# EAGLE design M5amigo (EAGLE 9.6.2)
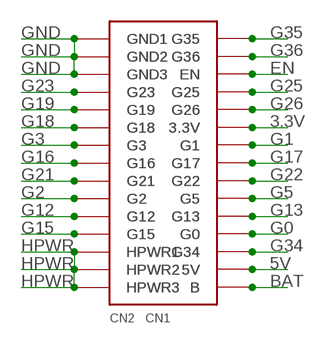
[diagram p0: schematic, sheet 1]

## Parts
CN1  CON_PINHD-2X15_BOTTOM  [2X15SMD]
CN2  CON_PINHD-2X15_TOP  [2X15SMD]

## Nets
3.3V: CN1.P$11(3.3V) CN2.P$12(3.3V)
5V: CN1.P$27(5V) CN2.P$28(5V)
BAT: CN1.P$29(B) CN2.P$30(B)
EN: CN1.P$5(EN) CN2.P$6(EN)
G0: CN1.P$23(G0) CN2.P$24(G0)
G1: CN1.P$13(G1) CN2.P$14(G1)
G2: CN1.P$20(G2) CN2.P$19(G2)
G3: CN1.P$14(G3) CN2.P$13(G3)
G5: CN1.P$19(G5) CN2.P$20(G5)
G12: CN1.P$22(G12) CN2.P$21(G12)
G13: CN1.P$21(G13) CN2.P$22(G13)
G15: CN1.P$24(G15) CN2.P$23(G15)
G16: CN1.P$16(G16) CN2.P$15(G16)
G17: CN1.P$15(G17) CN2.P$16(G17)
G18: CN1.P$12(G18) CN2.P$11(G18)
G19: CN1.P$10(G19) CN2.P$9(G19)
G21: CN1.P$18(G21) CN2.P$17(G21)
G22: CN1.P$17(G22) CN2.P$18(G22)
G23: CN1.P$8(G23) CN2.P$7(G23)
G25: CN1.P$7(G25) CN2.P$8(G25)
G26: CN1.P$9(G26) CN2.P$10(G26)
G34: CN1.P$25(G34) CN2.P$26(G34)
G35: CN1.P$1(G35) CN2.P$2(G35)
G36: CN1.P$3(G36) CN2.P$4(G36)
GND: CN1.P$2(GND1) CN1.P$4(GND2) CN1.P$6(GND3) CN2.P$1(GND1) CN2.P$3(GND2) CN2.P$5(GND3)
HPWR: CN1.P$26(HPWR1) CN1.P$28(HPWR2) CN1.P$30(HPWR3) CN2.P$25(HPWR1) CN2.P$27(HPWR2) CN2.P$29(HPWR3)

## Library data of the parts
CN1 = akita:CON_PINHD-2X15_BOTTOM
CN2 = akita:CON_PINHD-2X15_TOP

## Board
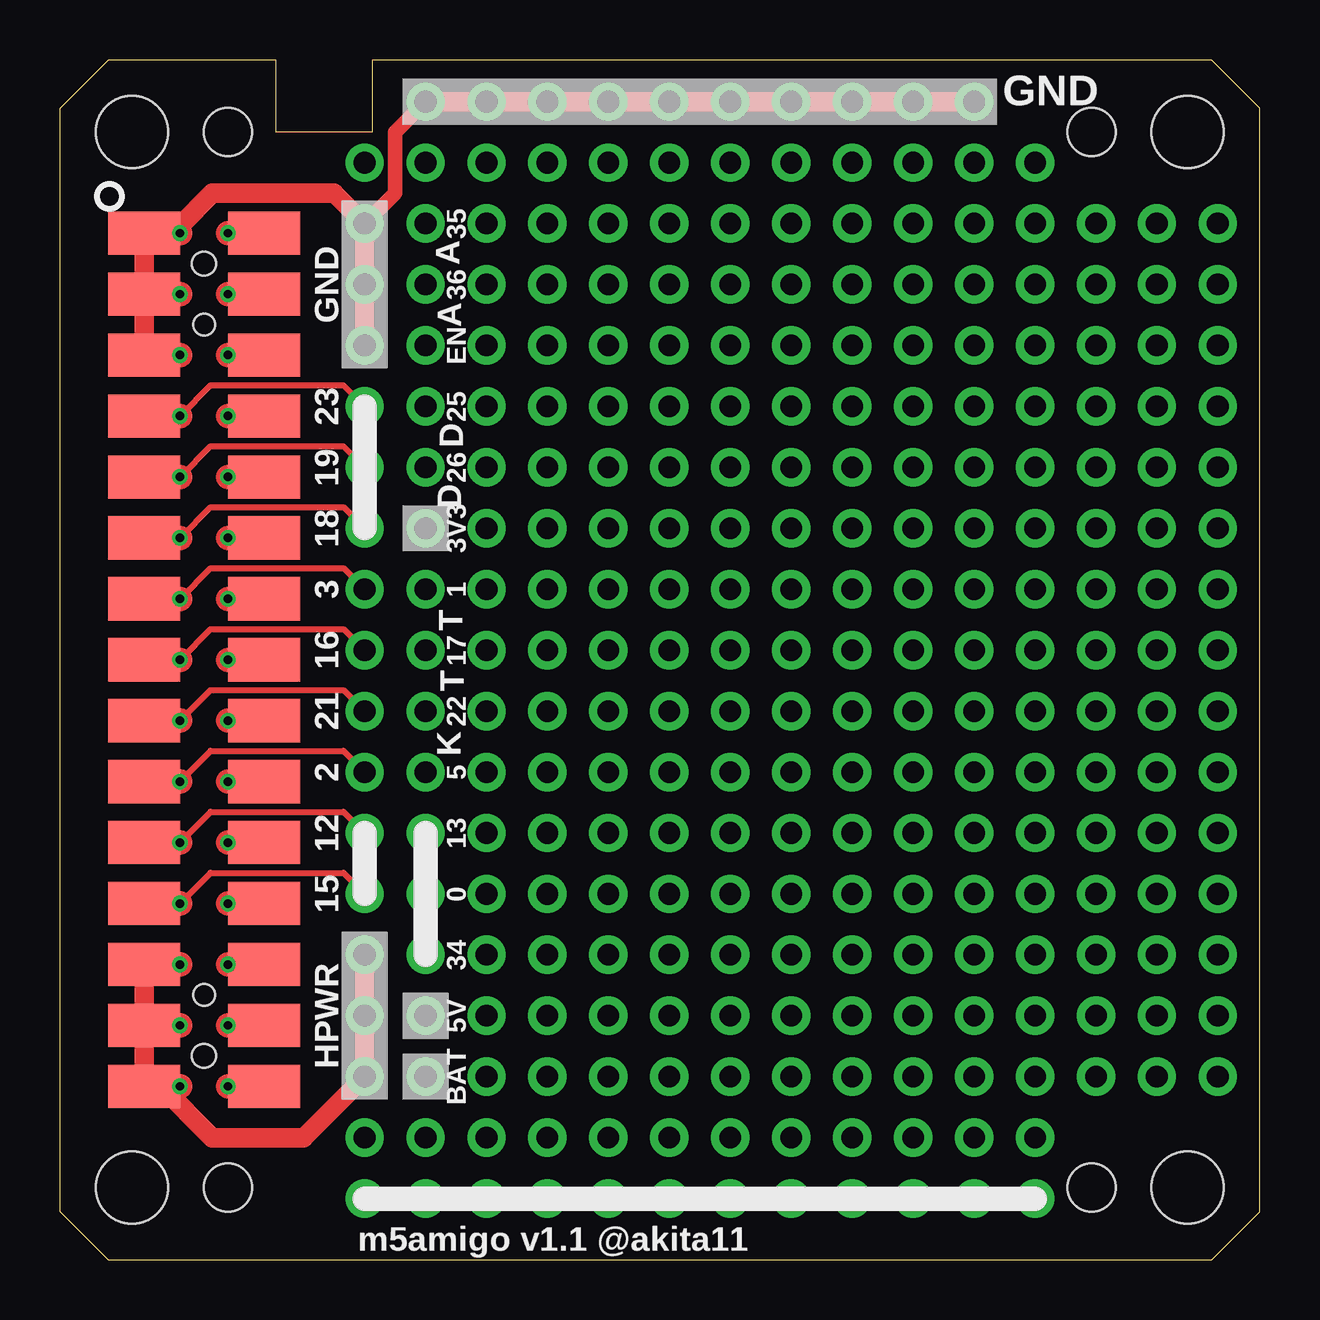
[diagram p1: board, top side]
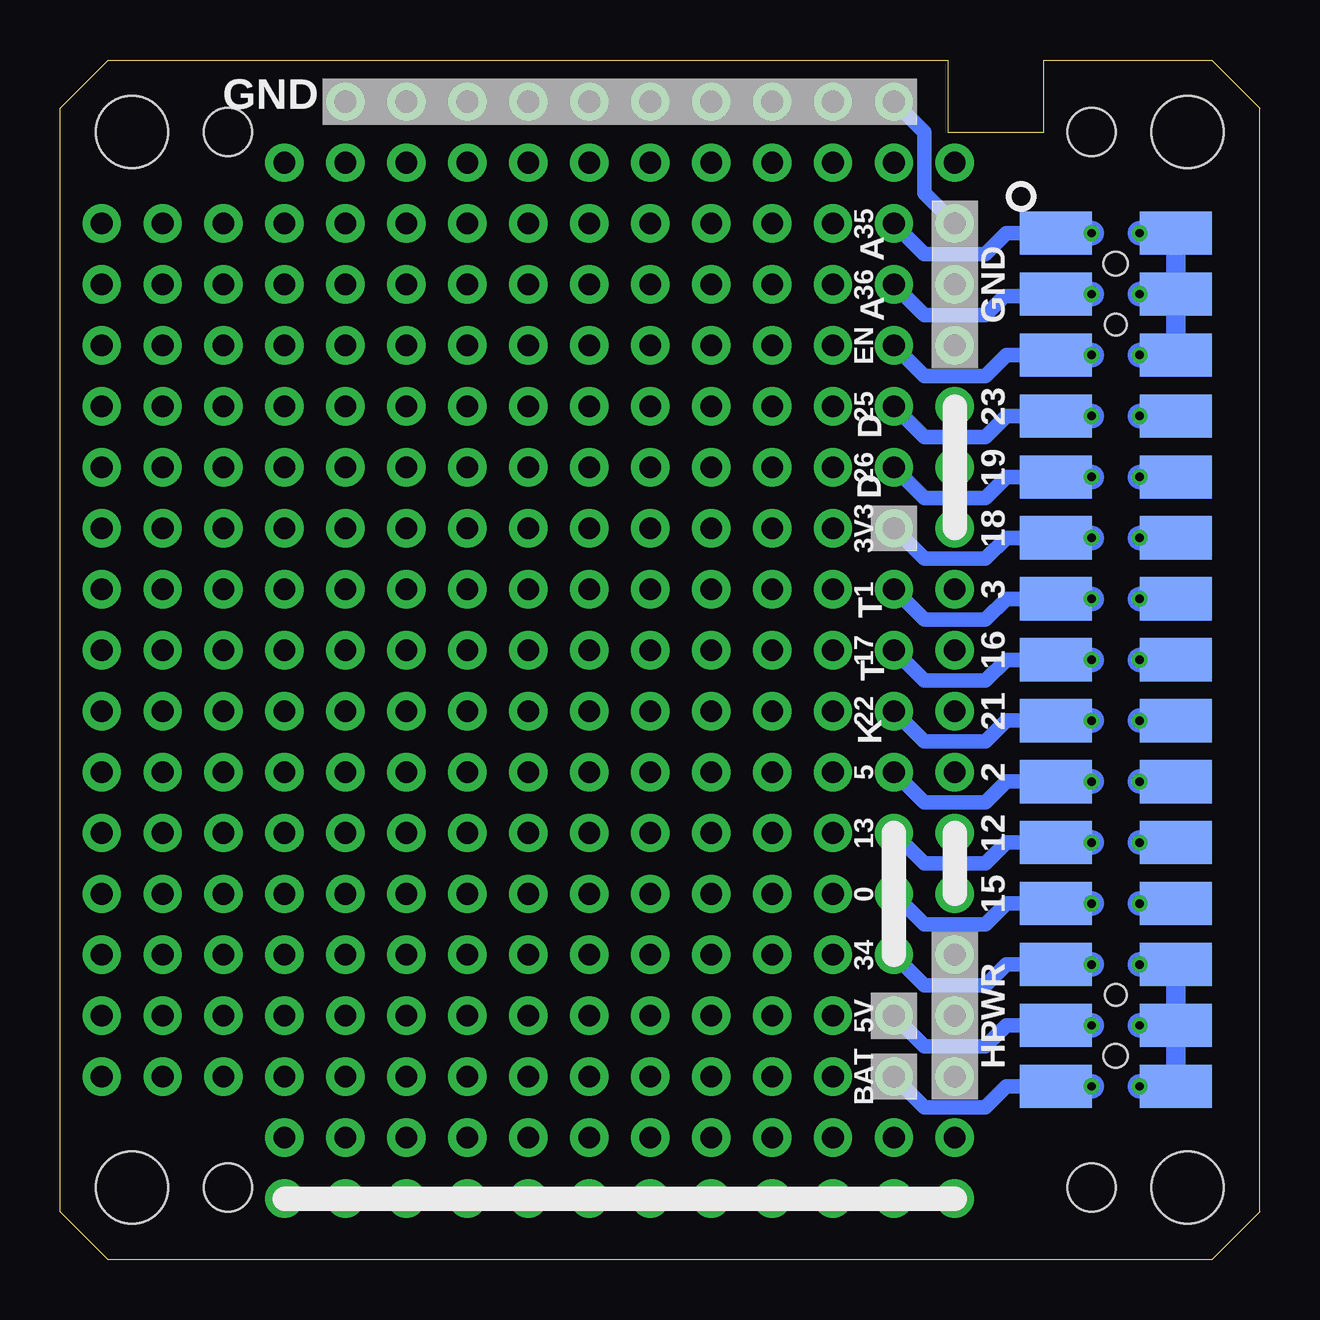
[diagram p2: board, bottom side, seen from below]

Size 50 x 50 mm. Coordinates in mm from the lower left corner, seen from the top.
Outline: 0,2 2,0 48,0 50,2 50,48 48,50 13,50 13,47 9,47 9,50 2,50 0,48 0,2
Copper layers (1*16): Top 0.035mm / dielectric 1.5mm / Bottom 0.035mm
Design rules "SeeedStudio_2layer_DRU_no_angle_20140221": minimum track width 6mil, minimum drill 12mil, track to track 6mil, track to pad 6mil, pad to pad 6mil, via to via 6mil, smd to smd 0mil, copper to edge 10mil, drill to drill 10mil, minimum pad ring 10mil, minimum via ring 6mil, stop-mask expansion 2mil, vias tented up to drill 100mil, thermal gap 10mil
Holes 3 mm at 3,3 3,47 47,47 47,3
Holes 2 mm at 7,3 7,47 43,47 43,3
Holes 1 mm at 6,41.51 6,8.49
Holes 0.9 mm at 6,38.97 6,11.03

### Footprints (pad centres in the part's own frame; a part is rotated, then mirrored left to right if it is on the bottom)
2X15SMD = smd 3 x 1.8: P$1 -2.5,17.78; P$2 2.5,17.78; P$3 -2.5,15.24; P$4 2.5,15.24; P$5 -2.5,12.7; P$6 2.5,12.7; P$7 -2.5,10.16; P$8 2.5,10.16; P$9 -2.5,7.62; P$10 2.5,7.62; P$11 -2.5,5.08; P$12 2.5,5.08; P$13 -2.5,2.54; P$14 2.5,2.54; P$15 -2.5,0; P$16 2.5,0; P$17 -2.5,-2.54; P$18 2.5,-2.54; P$19 -2.5,-5.08; P$20 2.5,-5.08; P$21 -2.5,-7.62; P$22 2.5,-7.62; P$23 -2.5,-10.16; P$24 2.5,-10.16; P$25 -2.5,-12.7; P$26 2.5,-12.7; P$27 -2.5,-15.24; P$28 2.5,-15.24; P$29 -2.5,-17.78; P$30 2.5,-17.78

### Placement (x,y rotation side)
CN1  6,25 0 bottom
CN2  6,25 0 top

### Tracks (layer width: path | path; a pad name or v marks a point on that pad's centre or on a via)
3.3V  (via drill 0.35, 0.9 pad 1.6)
  Top 1.016: CN1.P$11 v7,30.08
  Bottom 0.61: v15.24,30.48 13.97,29.21 11.43,29.21 10.56,30.08 CN1.P$11
  Bottom 1.016: v7,30.08 CN1.P$11
5V  (via drill 0.35, 0.9 pad 1.6)
  Top 1.016: CN1.P$27 v7,9.76
  Bottom 0.61: v15.24,10.16 13.97,8.89 11.43,8.89 10.56,9.76 CN1.P$27
  Bottom 1.016: v7,9.76 CN1.P$27
BAT  (via drill 0.35, 0.9 pad 1.6)
  Top 1.016: v7,7.22 CN1.P$29
  Bottom 0.61: v15.24,7.62 13.97,6.35 11.43,6.35 10.56,7.22 CN1.P$29
  Bottom 1.016: CN1.P$29 v7,7.22
EN  (via drill 0.35, 0.9 pad 1.6)
  Top 1.016: v7,37.7 CN1.P$5
  Bottom 0.61: v15.24,38.1 13.97,36.83 11.43,36.83 10.56,37.7 CN1.P$5
  Bottom 1.016: CN1.P$5 v7,37.7
G0  (via drill 0.35, 0.9 pad 1.6)
  Top 1.016: CN1.P$23 v7,14.84
  Bottom 0.61: v15.24,15.24 13.97,13.97 11.43,13.97 10.56,14.84 CN1.P$23
  Bottom 1.016: v7,14.84 CN1.P$23
G1  (via drill 0.35, 0.9 pad 1.6)
  Top 1.016: v7,27.54 CN1.P$13
  Bottom 0.61: v15.24,27.94 13.97,26.67 11.43,26.67 10.56,27.54 CN1.P$13
  Bottom 1.016: CN1.P$13 v7,27.54
G2  (via drill 0.35, 0.9 pad 1.6)
  Top 0.254: v12.7,20.32 11.82,21.2 6.28,21.2 v5,19.92
  Top 0.61: 5.16,19.92 v5,19.92
  Top 1.016: v5,19.92 CN1.P$20
  Bottom 1.016: CN1.P$20 v5,19.92
G3  (via drill 0.35, 0.9 pad 1.6)
  Top 0.254: v12.7,27.94 11.82,28.82 6.28,28.82 v5,27.54
  Top 1.016: CN1.P$14 v5,27.54
  Bottom 1.016: v5,27.54 CN1.P$14
G5  (via drill 0.35, 0.9 pad 1.6)
  Top 1.016: CN1.P$19 v7,19.92
  Bottom 0.61: v15.24,20.32 13.97,19.05 11.43,19.05 10.56,19.92 CN1.P$19
  Bottom 1.016: v7,19.92 CN1.P$19
G12  (via drill 0.35, 0.9 pad 1.6)
  Top 0.254: 5.32,17.38 v5,17.38 6.28,18.66 11.82,18.66 v12.7,17.78
  Top 1.016: CN1.P$22 v5,17.38
  Bottom 1.016: v5,17.38 CN1.P$22
G13  (via drill 0.35, 0.9 pad 1.6)
  Top 1.016: v7,17.38 CN1.P$21
  Bottom 0.61: v15.24,17.78 13.97,16.51 11.43,16.51 10.56,17.38 CN1.P$21
  Bottom 1.016: CN1.P$21 v7,17.38
G15  (via drill 0.35, 0.9 pad 1.6)
  Top 0.254: v12.7,15.24 11.82,16.12 6.28,16.12 v5,14.84
  Top 1.016: v5,14.84 CN1.P$24
  Bottom 1.016: CN1.P$24 v5,14.84
G16  (via drill 0.35, 0.9 pad 1.6)
  Top 0.254: v12.7,25.4 11.82,26.28 6.28,26.28 v5,25
  Top 1.016: v5,25 CN1.P$16
  Bottom 1.016: CN1.P$16 v5,25
G17  (via drill 0.35, 0.9 pad 1.6)
  Top 1.016: CN1.P$15 v7,25
  Bottom 0.61: v15.24,25.4 13.97,24.13 11.43,24.13 10.56,25 CN1.P$15
  Bottom 1.016: v7,25 CN1.P$15
G18  (via drill 0.35, 0.9 pad 1.6)
  Top 0.254: v12.7,30.48 11.82,31.36 6.28,31.36 v5,30.08
  Top 1.016: v5,30.08 CN1.P$12
  Bottom 1.016: CN1.P$12 v5,30.08
G19  (via drill 0.35, 0.9 pad 1.6)
  Top 0.254: v12.7,33.02 11.82,33.9 6.28,33.9 v5,32.62
  Top 1.016: CN1.P$10 v5,32.62
  Bottom 1.016: v5,32.62 CN1.P$10
G21  (via drill 0.35, 0.9 pad 1.6)
  Top 0.254: v12.7,22.86 11.82,23.74 6.28,23.74 v5,22.46
  Top 0.61: 5.16,22.46 v5,22.46
  Top 1.016: CN1.P$18 v5,22.46
  Bottom 1.016: v5,22.46 CN1.P$18
G22  (via drill 0.35, 0.9 pad 1.6)
  Top 1.016: v7,22.46 CN1.P$17
  Bottom 0.61: v15.24,22.86 13.97,21.59 11.43,21.59 10.56,22.46 8.89,22.46
  Bottom 1.016: CN1.P$17 8.89,22.46 v7,22.46
G23  (via drill 0.35, 0.9 pad 1.6)
  Top 0.254: v12.7,35.56 11.82,36.44 6.28,36.44 v5,35.16
  Top 0.61: 5.16,35.16 v5,35.16
  Top 1.016: v5,35.16 CN1.P$8
  Bottom 1.016: CN1.P$8 v5,35.16
G25  (via drill 0.35, 0.9 pad 1.6)
  Top 1.016: CN1.P$7 v7,35.16
  Bottom 0.61: v15.24,35.56 13.97,34.29 11.43,34.29 10.56,35.16 CN1.P$7
  Bottom 1.016: v7,35.16 CN1.P$7
G26  (via drill 0.35, 0.9 pad 1.6)
  Top 1.016: CN1.P$9 v7,32.62
  Bottom 0.61: v15.24,33.02 13.97,31.75 11.43,31.75 10.56,32.62 CN1.P$9
  Bottom 1.016: CN1.P$9 v7,32.62
G34  (via drill 0.35, 0.9 pad 1.6)
  Top 1.016: v7,12.3 CN1.P$25
  Bottom 0.61: v15.24,12.7 13.97,11.43 11.43,11.43 10.56,12.3 CN1.P$25
  Bottom 1.016: CN1.P$25 v7,12.3
G35  (via drill 0.35, 0.9 pad 1.6)
  Top 1.016: v7,42.78 CN1.P$1
  Bottom 0.61: CN1.P$1 10.56,42.78 11.43,41.91 13.97,41.91 v15.24,43.18
  Bottom 1.016: CN1.P$1 v7,42.78
G36  (via drill 0.35, 0.9 pad 1.6)
  Top 1.016: CN1.P$3 v7,40.24
  Bottom 0.61: CN1.P$3 9.25,40.16 10.64,40.16 11.43,39.37 13.97,39.37 v15.24,40.64
  Bottom 1.016: v7,40.24 CN1.P$3
GND  (via drill 0.35, 0.9 pad 1.6)
  Top 0.61: 5.16,42.78 v5,42.78 | v15.24,48.26 13.97,46.99 13.97,44.45 v12.7,43.18
  Top 0.813: CN1.P$6 CN1.P$4 CN1.P$2 2.83,42.76 | v12.7,38.1 v12.7,40.64 v12.7,43.18 11.43,44.45 6.35,44.45 5,43.1 v5,42.78 | v15.24,48.26 v17.78,48.26 v20.32,48.26 v22.86,48.26 v25.4,48.26 v27.94,48.26 v30.48,48.26 v33.02,48.26 v35.56,48.26 v38.1,48.26
  Top 1.016: CN1.P$6 v5,37.7 | CN1.P$2 v5,42.78 | v5,40.24 CN1.P$4
  Bottom 0.61: v12.7,43.18 13.97,44.45 13.97,46.99 v15.24,48.26
  Bottom 0.813: CN1.P$2 CN1.P$4 CN1.P$6
  Bottom 1.016: v5,37.7 CN1.P$6 | v5,42.78 CN1.P$2 | CN1.P$4 v5,40.24
HPWR  (via drill 0.35, 0.9 pad 1.6)
  Top 0.813: CN1.P$26 CN1.P$28 CN1.P$30 4.21,7.22 6.35,5.08 10.16,5.08 v12.7,7.62 v12.7,10.16 v12.7,12.7
  Top 1.016: CN1.P$30 v5,7.22 | CN1.P$26 v5,12.3 | v5,9.76 CN1.P$28
  Bottom 0.813: CN1.P$30 CN1.P$28 CN1.P$26
  Bottom 1.016: v5,7.22 CN1.P$30 | v5,12.3 CN1.P$26 | CN1.P$28 v5,9.76
N$2  (via drill 0.9 pad 1.6)
  other vias: 12.7,45.72
N$18  (via drill 0.9 pad 1.6)
  other vias: 12.7,5.08
N$19  (via drill 0.9 pad 1.6)
  Top 1.016: v30.48,2.54 v33.02,2.54 v38.1,2.54 | v12.7,2.54 v17.78,2.54 | v30.48,2.54 v25.4,2.54 v22.86,2.54 v20.32,2.54 v17.78,2.54 | v30.48,2.54 v38.1,2.54 | v38.1,2.54 v40.64,2.54 | v35.56,2.54 v38.1,2.54 | v27.94,2.54 v30.48,2.54 | v15.24,2.54 v17.78,2.54
N$21  (via drill 0.9 pad 1.6)
  other vias: 15.24,45.72
N$37  (via drill 0.9 pad 1.6)
  other vias: 15.24,5.08
N$40  (via drill 0.9 pad 1.6)
  other vias: 17.78,45.72
N$41  (via drill 0.9 pad 1.6)
  other vias: 17.78,43.18
N$42  (via drill 0.9 pad 1.6)
  other vias: 17.78,40.64
N$43  (via drill 0.9 pad 1.6)
  other vias: 17.78,38.1
N$44  (via drill 0.9 pad 1.6)
  other vias: 17.78,35.56
N$45  (via drill 0.9 pad 1.6)
  other vias: 17.78,33.02
N$46  (via drill 0.9 pad 1.6)
  other vias: 17.78,30.48
N$47  (via drill 0.9 pad 1.6)
  other vias: 17.78,27.94
N$48  (via drill 0.9 pad 1.6)
  other vias: 17.78,25.4
N$49  (via drill 0.9 pad 1.6)
  other vias: 17.78,22.86
N$50  (via drill 0.9 pad 1.6)
  other vias: 17.78,20.32
N$51  (via drill 0.9 pad 1.6)
  other vias: 17.78,17.78
N$52  (via drill 0.9 pad 1.6)
  other vias: 17.78,15.24
N$53  (via drill 0.9 pad 1.6)
  other vias: 17.78,12.7
N$54  (via drill 0.9 pad 1.6)
  other vias: 17.78,10.16
N$55  (via drill 0.9 pad 1.6)
  other vias: 17.78,7.62
N$56  (via drill 0.9 pad 1.6)
  other vias: 17.78,5.08
N$59  (via drill 0.9 pad 1.6)
  other vias: 20.32,45.72
N$60  (via drill 0.9 pad 1.6)
  other vias: 20.32,43.18
N$61  (via drill 0.9 pad 1.6)
  other vias: 20.32,40.64
N$62  (via drill 0.9 pad 1.6)
  other vias: 20.32,38.1
N$63  (via drill 0.9 pad 1.6)
  other vias: 20.32,35.56
N$64  (via drill 0.9 pad 1.6)
  other vias: 20.32,33.02
N$65  (via drill 0.9 pad 1.6)
  other vias: 20.32,30.48
N$66  (via drill 0.9 pad 1.6)
  other vias: 20.32,27.94
N$67  (via drill 0.9 pad 1.6)
  other vias: 20.32,25.4
N$68  (via drill 0.9 pad 1.6)
  other vias: 20.32,22.86
N$69  (via drill 0.9 pad 1.6)
  other vias: 20.32,20.32
N$70  (via drill 0.9 pad 1.6)
  other vias: 20.32,17.78
N$71  (via drill 0.9 pad 1.6)
  other vias: 20.32,15.24
N$72  (via drill 0.9 pad 1.6)
  other vias: 20.32,12.7
N$73  (via drill 0.9 pad 1.6)
  other vias: 20.32,10.16
N$74  (via drill 0.9 pad 1.6)
  other vias: 20.32,7.62
N$75  (via drill 0.9 pad 1.6)
  other vias: 20.32,5.08
N$78  (via drill 0.9 pad 1.6)
  other vias: 22.86,45.72
N$79  (via drill 0.9 pad 1.6)
  other vias: 22.86,43.18
N$80  (via drill 0.9 pad 1.6)
  other vias: 22.86,40.64
N$81  (via drill 0.9 pad 1.6)
  other vias: 22.86,38.1
N$82  (via drill 0.9 pad 1.6)
  other vias: 22.86,35.56
N$83  (via drill 0.9 pad 1.6)
  other vias: 22.86,33.02
N$84  (via drill 0.9 pad 1.6)
  other vias: 22.86,30.48
N$85  (via drill 0.9 pad 1.6)
  other vias: 22.86,27.94
N$86  (via drill 0.9 pad 1.6)
  other vias: 22.86,25.4
N$87  (via drill 0.9 pad 1.6)
  other vias: 22.86,22.86
N$88  (via drill 0.9 pad 1.6)
  other vias: 22.86,20.32
N$89  (via drill 0.9 pad 1.6)
  other vias: 22.86,17.78
N$90  (via drill 0.9 pad 1.6)
  other vias: 22.86,15.24
N$91  (via drill 0.9 pad 1.6)
  other vias: 22.86,12.7
N$92  (via drill 0.9 pad 1.6)
  other vias: 22.86,10.16
N$93  (via drill 0.9 pad 1.6)
  other vias: 22.86,7.62
N$94  (via drill 0.9 pad 1.6)
  other vias: 22.86,5.08
N$97  (via drill 0.9 pad 1.6)
  other vias: 25.4,45.72
N$98  (via drill 0.9 pad 1.6)
  other vias: 25.4,43.18
N$99  (via drill 0.9 pad 1.6)
  other vias: 25.4,40.64
N$100  (via drill 0.9 pad 1.6)
  other vias: 25.4,38.1
N$101  (via drill 0.9 pad 1.6)
  other vias: 25.4,35.56
N$102  (via drill 0.9 pad 1.6)
  other vias: 25.4,33.02
N$103  (via drill 0.9 pad 1.6)
  other vias: 25.4,30.48
N$104  (via drill 0.9 pad 1.6)
  other vias: 25.4,27.94
N$105  (via drill 0.9 pad 1.6)
  other vias: 25.4,25.4
N$106  (via drill 0.9 pad 1.6)
  other vias: 25.4,22.86
N$107  (via drill 0.9 pad 1.6)
  other vias: 25.4,20.32
N$108  (via drill 0.9 pad 1.6)
  other vias: 25.4,17.78
N$109  (via drill 0.9 pad 1.6)
  other vias: 25.4,15.24
N$110  (via drill 0.9 pad 1.6)
  other vias: 25.4,12.7
N$111  (via drill 0.9 pad 1.6)
  other vias: 25.4,10.16
N$112  (via drill 0.9 pad 1.6)
  other vias: 25.4,7.62
N$113  (via drill 0.9 pad 1.6)
  other vias: 25.4,5.08
N$116  (via drill 0.9 pad 1.6)
  other vias: 27.94,45.72
N$117  (via drill 0.9 pad 1.6)
  other vias: 27.94,43.18
N$118  (via drill 0.9 pad 1.6)
  other vias: 27.94,40.64
N$119  (via drill 0.9 pad 1.6)
  other vias: 27.94,38.1
N$120  (via drill 0.9 pad 1.6)
  other vias: 27.94,35.56
N$121  (via drill 0.9 pad 1.6)
  other vias: 27.94,33.02
N$122  (via drill 0.9 pad 1.6)
  other vias: 27.94,30.48
N$123  (via drill 0.9 pad 1.6)
  other vias: 27.94,27.94
N$124  (via drill 0.9 pad 1.6)
  other vias: 27.94,25.4
N$125  (via drill 0.9 pad 1.6)
  other vias: 27.94,22.86
N$126  (via drill 0.9 pad 1.6)
  other vias: 27.94,20.32
N$127  (via drill 0.9 pad 1.6)
  other vias: 27.94,17.78
N$128  (via drill 0.9 pad 1.6)
  other vias: 27.94,15.24
N$129  (via drill 0.9 pad 1.6)
  other vias: 27.94,12.7
N$130  (via drill 0.9 pad 1.6)
  other vias: 27.94,10.16
N$131  (via drill 0.9 pad 1.6)
  other vias: 27.94,7.62
N$132  (via drill 0.9 pad 1.6)
  other vias: 27.94,5.08
N$135  (via drill 0.9 pad 1.6)
  other vias: 30.48,45.72
N$136  (via drill 0.9 pad 1.6)
  other vias: 30.48,43.18
N$137  (via drill 0.9 pad 1.6)
  other vias: 30.48,40.64
N$138  (via drill 0.9 pad 1.6)
  other vias: 30.48,38.1
N$139  (via drill 0.9 pad 1.6)
  other vias: 30.48,35.56
N$140  (via drill 0.9 pad 1.6)
  other vias: 30.48,33.02
N$141  (via drill 0.9 pad 1.6)
  other vias: 30.48,30.48
N$142  (via drill 0.9 pad 1.6)
  other vias: 30.48,27.94
N$143  (via drill 0.9 pad 1.6)
  other vias: 30.48,25.4
N$144  (via drill 0.9 pad 1.6)
  other vias: 30.48,22.86
N$145  (via drill 0.9 pad 1.6)
  other vias: 30.48,20.32
N$146  (via drill 0.9 pad 1.6)
  other vias: 30.48,17.78
N$147  (via drill 0.9 pad 1.6)
  other vias: 30.48,15.24
N$148  (via drill 0.9 pad 1.6)
  other vias: 30.48,12.7
N$149  (via drill 0.9 pad 1.6)
  other vias: 30.48,10.16
N$150  (via drill 0.9 pad 1.6)
  other vias: 30.48,7.62
N$151  (via drill 0.9 pad 1.6)
  other vias: 30.48,5.08
N$154  (via drill 0.9 pad 1.6)
  other vias: 33.02,45.72
N$155  (via drill 0.9 pad 1.6)
  other vias: 33.02,43.18
N$156  (via drill 0.9 pad 1.6)
  other vias: 33.02,40.64
N$157  (via drill 0.9 pad 1.6)
  other vias: 33.02,38.1
N$158  (via drill 0.9 pad 1.6)
  other vias: 33.02,35.56
N$159  (via drill 0.9 pad 1.6)
  other vias: 33.02,33.02
N$160  (via drill 0.9 pad 1.6)
  other vias: 33.02,30.48
N$161  (via drill 0.9 pad 1.6)
  other vias: 33.02,27.94
N$162  (via drill 0.9 pad 1.6)
  other vias: 33.02,25.4
N$163  (via drill 0.9 pad 1.6)
  other vias: 33.02,22.86
N$164  (via drill 0.9 pad 1.6)
  other vias: 33.02,20.32
N$165  (via drill 0.9 pad 1.6)
  other vias: 33.02,17.78
N$166  (via drill 0.9 pad 1.6)
  other vias: 33.02,15.24
N$167  (via drill 0.9 pad 1.6)
  other vias: 33.02,12.7
N$168  (via drill 0.9 pad 1.6)
  other vias: 33.02,10.16
N$169  (via drill 0.9 pad 1.6)
  other vias: 33.02,7.62
N$170  (via drill 0.9 pad 1.6)
  other vias: 33.02,5.08
N$173  (via drill 0.9 pad 1.6)
  other vias: 35.56,45.72
N$174  (via drill 0.9 pad 1.6)
  other vias: 35.56,43.18
N$175  (via drill 0.9 pad 1.6)
  other vias: 35.56,40.64
N$176  (via drill 0.9 pad 1.6)
  other vias: 35.56,38.1
N$177  (via drill 0.9 pad 1.6)
  other vias: 35.56,35.56
N$178  (via drill 0.9 pad 1.6)
  other vias: 35.56,33.02
N$179  (via drill 0.9 pad 1.6)
  other vias: 35.56,30.48
N$180  (via drill 0.9 pad 1.6)
  other vias: 35.56,27.94
N$181  (via drill 0.9 pad 1.6)
  other vias: 35.56,25.4
N$182  (via drill 0.9 pad 1.6)
  other vias: 35.56,22.86
N$183  (via drill 0.9 pad 1.6)
  other vias: 35.56,20.32
N$184  (via drill 0.9 pad 1.6)
  other vias: 35.56,17.78
N$185  (via drill 0.9 pad 1.6)
  other vias: 35.56,15.24
N$186  (via drill 0.9 pad 1.6)
  other vias: 35.56,12.7
N$187  (via drill 0.9 pad 1.6)
  other vias: 35.56,10.16
N$188  (via drill 0.9 pad 1.6)
  other vias: 35.56,7.62
N$189  (via drill 0.9 pad 1.6)
  other vias: 35.56,5.08
N$192  (via drill 0.9 pad 1.6)
  other vias: 38.1,45.72
N$193  (via drill 0.9 pad 1.6)
  other vias: 38.1,43.18
N$194  (via drill 0.9 pad 1.6)
  other vias: 38.1,40.64
N$195  (via drill 0.9 pad 1.6)
  other vias: 38.1,38.1
N$196  (via drill 0.9 pad 1.6)
  other vias: 38.1,35.56
N$197  (via drill 0.9 pad 1.6)
  other vias: 38.1,33.02
N$198  (via drill 0.9 pad 1.6)
  other vias: 38.1,30.48
N$199  (via drill 0.9 pad 1.6)
  other vias: 38.1,27.94
N$200  (via drill 0.9 pad 1.6)
  other vias: 38.1,25.4
N$201  (via drill 0.9 pad 1.6)
  other vias: 38.1,22.86
N$202  (via drill 0.9 pad 1.6)
  other vias: 38.1,20.32
N$203  (via drill 0.9 pad 1.6)
  other vias: 38.1,17.78
N$204  (via drill 0.9 pad 1.6)
  other vias: 38.1,15.24
N$205  (via drill 0.9 pad 1.6)
  other vias: 38.1,12.7
N$206  (via drill 0.9 pad 1.6)
  other vias: 38.1,10.16
N$207  (via drill 0.9 pad 1.6)
  other vias: 38.1,7.62
N$208  (via drill 0.9 pad 1.6)
  other vias: 38.1,5.08
N$211  (via drill 0.9 pad 1.6)
  other vias: 40.64,45.72
N$212  (via drill 0.9 pad 1.6)
  other vias: 40.64,43.18
N$213  (via drill 0.9 pad 1.6)
  other vias: 40.64,40.64
N$214  (via drill 0.9 pad 1.6)
  other vias: 40.64,38.1
N$215  (via drill 0.9 pad 1.6)
  other vias: 40.64,35.56
N$216  (via drill 0.9 pad 1.6)
  other vias: 40.64,33.02
N$217  (via drill 0.9 pad 1.6)
  other vias: 40.64,30.48
N$218  (via drill 0.9 pad 1.6)
  other vias: 40.64,27.94
N$219  (via drill 0.9 pad 1.6)
  other vias: 40.64,25.4
N$220  (via drill 0.9 pad 1.6)
  other vias: 40.64,22.86
N$221  (via drill 0.9 pad 1.6)
  other vias: 40.64,20.32
N$222  (via drill 0.9 pad 1.6)
  other vias: 40.64,17.78
N$223  (via drill 0.9 pad 1.6)
  other vias: 40.64,15.24
N$224  (via drill 0.9 pad 1.6)
  other vias: 40.64,12.7
N$225  (via drill 0.9 pad 1.6)
  other vias: 40.64,10.16
N$226  (via drill 0.9 pad 1.6)
  other vias: 40.64,7.62
N$227  (via drill 0.9 pad 1.6)
  other vias: 40.64,5.08
N$231  (via drill 0.9 pad 1.6)
  other vias: 43.18,43.18
N$232  (via drill 0.9 pad 1.6)
  other vias: 43.18,40.64
N$233  (via drill 0.9 pad 1.6)
  other vias: 43.18,38.1
N$234  (via drill 0.9 pad 1.6)
  other vias: 43.18,35.56
N$235  (via drill 0.9 pad 1.6)
  other vias: 43.18,33.02
N$236  (via drill 0.9 pad 1.6)
  other vias: 43.18,30.48
N$237  (via drill 0.9 pad 1.6)
  other vias: 43.18,27.94
N$238  (via drill 0.9 pad 1.6)
  other vias: 43.18,25.4
N$239  (via drill 0.9 pad 1.6)
  other vias: 43.18,22.86
N$240  (via drill 0.9 pad 1.6)
  other vias: 43.18,20.32
N$241  (via drill 0.9 pad 1.6)
  other vias: 43.18,17.78
N$242  (via drill 0.9 pad 1.6)
  other vias: 43.18,15.24
N$243  (via drill 0.9 pad 1.6)
  other vias: 43.18,12.7
N$244  (via drill 0.9 pad 1.6)
  other vias: 43.18,10.16
N$245  (via drill 0.9 pad 1.6)
  other vias: 43.18,7.62
N$250  (via drill 0.9 pad 1.6)
  other vias: 45.72,43.18
N$251  (via drill 0.9 pad 1.6)
  other vias: 45.72,40.64
N$252  (via drill 0.9 pad 1.6)
  other vias: 45.72,38.1
N$253  (via drill 0.9 pad 1.6)
  other vias: 45.72,35.56
N$254  (via drill 0.9 pad 1.6)
  other vias: 45.72,33.02
N$255  (via drill 0.9 pad 1.6)
  other vias: 45.72,30.48
N$256  (via drill 0.9 pad 1.6)
  other vias: 45.72,27.94
N$257  (via drill 0.9 pad 1.6)
  other vias: 45.72,25.4
N$258  (via drill 0.9 pad 1.6)
  other vias: 45.72,22.86
N$259  (via drill 0.9 pad 1.6)
  other vias: 45.72,20.32
N$260  (via drill 0.9 pad 1.6)
  other vias: 45.72,17.78
N$261  (via drill 0.9 pad 1.6)
  other vias: 45.72,15.24
N$262  (via drill 0.9 pad 1.6)
  other vias: 45.72,12.7
N$263  (via drill 0.9 pad 1.6)
  other vias: 45.72,10.16
N$264  (via drill 0.9 pad 1.6)
  other vias: 45.72,7.62
N$269  (via drill 0.9 pad 1.6)
  other vias: 48.26,43.18
N$270  (via drill 0.9 pad 1.6)
  other vias: 48.26,40.64
N$271  (via drill 0.9 pad 1.6)
  other vias: 48.26,38.1
N$272  (via drill 0.9 pad 1.6)
  other vias: 48.26,35.56
N$273  (via drill 0.9 pad 1.6)
  other vias: 48.26,33.02
N$274  (via drill 0.9 pad 1.6)
  other vias: 48.26,30.48
N$275  (via drill 0.9 pad 1.6)
  other vias: 48.26,27.94
N$276  (via drill 0.9 pad 1.6)
  other vias: 48.26,25.4
N$277  (via drill 0.9 pad 1.6)
  other vias: 48.26,22.86
N$278  (via drill 0.9 pad 1.6)
  other vias: 48.26,20.32
N$279  (via drill 0.9 pad 1.6)
  other vias: 48.26,17.78
N$280  (via drill 0.9 pad 1.6)
  other vias: 48.26,15.24
N$281  (via drill 0.9 pad 1.6)
  other vias: 48.26,12.7
N$282  (via drill 0.9 pad 1.6)
  other vias: 48.26,10.16
N$283  (via drill 0.9 pad 1.6)
  other vias: 48.26,7.62

### Text on the board
tPlace: GND | 35 | A | GND | 36 | A | EN | 23 | 25 | D | 19 | 26 | D | 18 | 3V3 | 3 | 1 | T | 16 | T | 17 | 21 | 22 | K | 2 | 5 | 12 | 13 | 15 | 0 | 34 | HPWR | 5V | BAT | m5amigo v1.1 @akita11
bPlace: GND | 35 | A | GND | 36 | A | EN | 23 | 25 | D | 19 | 26 | D | 18 | 3V3 | 3 | 1 | T | 16 | 17 | T | 21 | 22 | K | 2 | 5 | 12 | 13 | 15 | 0 | 34 | HPWR | 5V | BAT